# EAGLE design LNA (EAGLE 9.6.2)
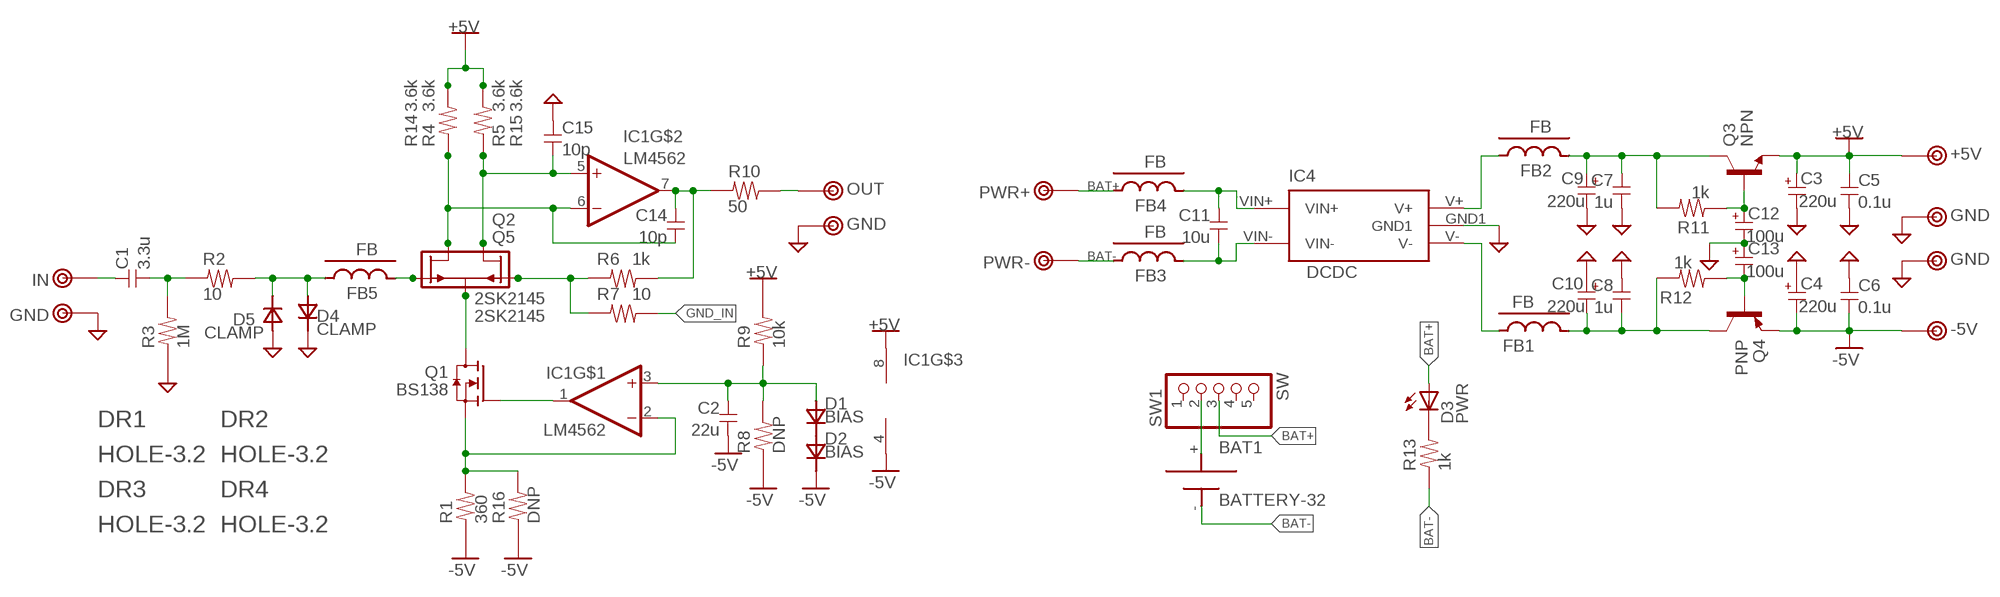
[diagram p0: schematic, sheet 1]

## Parts
BAT1  BATTERY-32  [BH-321]
C1  3.3u  C-3225  [3225]
C2  22u  C-3225  [3225]
C3  220u  CPOLE2.5-8  [E2,5-8]
C4  220u  CPOLE2.5-8  [E2,5-8]
C5  0.1u  C-1608  [1608C]
C6  0.1u  C-1608  [1608C]
C7  1u  C-1608  [1608C]
C8  1u  C-1608  [1608C]
C9  220u  CPOLE2.5-8  [E2,5-8]
C10  220u  CPOLE2.5-8  [E2,5-8]
C11  10u  C-2012  [2012]
C12  100u  CPOLE2.5-6.5  [E2.5-6.5]
C13  100u  CPOLE2.5-6.5  [E2.5-6.5]
C14  10p  C-1608  [1608C]
C15  10p  C-1608  [1608C]
D1  BIAS  DIODE-1N4148W  [SOD123]
D2  BIAS  DIODE-1N4148W  [SOD123]
D3  PWR  LED-SMD1608  [D1608]
D4  CLAMP  DIODE-323  [SOD323]
D5  CLAMP  DIODE-323  [SOD323]
DR1  HOLE-3.2  [HOLE_3.2]
DR2  HOLE-3.2  [HOLE_3.2]
DR3  HOLE-3.2  [HOLE_3.2]
DR4  HOLE-3.2  [HOLE_3.2]
FB1  FB  FB-1608FB  [1608-FB]
FB2  FB  FB-1608FB  [1608-FB]
FB3  FB  FB-1608FB  [1608-FB]
FB4  FB  FB-1608FB  [1608-FB]
FB5  FB  FB-1608FB  [1608-FB]
IC1  LM4562  OPA-2-SOP  [SOP8]
IC4  DCDC  DCDC2  [DCDC2]
Q1  BS138  NMOS-SMD  [SC59]
Q2  2SK2145  JFET-DUAL  [SOT23-5]
Q3  NPN  NPN-SOT223  [SOT223]
Q4  PNP  PNP-SOT223  [SOT223]
Q5  2SK2145  JFET-DUAL  [SOT23-5]
R1  360  R-1608  [1608]
R2  10  R-1608  [1608]
R3  1M  R-1608  [1608]
R4  3.6k  R-1608  [1608]
R5  3.6k  R-1608  [1608]
R6  1k  R-1608  [1608]
R7  10  R-1608  [1608]
R8  DNP  R-1608  [1608]
R9  10k  R-1608  [1608]
R10  50  R-1608  [1608]
R11  1k  R-1608  [1608]
R12  1k  R-1608  [1608]
R13  1k  R-1608  [1608]
R14  3.6k  R-1608  [1608]
R15  3.6k  R-1608  [1608]
R16  DNP  R-1608  [1608]
SW1  SW  SW-1X5  [1X05-BIG]
TP1  IN  TESTPIN  [TESTPIN]
TP2  GND  TESTPIN  [TESTPIN]
TP3  OUT  TESTPIN  [TESTPIN]
TP4  GND  TESTPIN  [TESTPIN]
TP5  PWR+  TESTPIN  [TESTPIN]
TP6  PWR-  TESTPIN  [TESTPIN]
TP7  +5V  TESTPIN-MID  [TESTPIN-MID]
TP8  GND  TESTPIN-MID  [TESTPIN-MID]
TP9  GND  TESTPIN-MID  [TESTPIN-MID]
TP10  -5V  TESTPIN-MID  [TESTPIN-MID]

## Nets
+5V: C3.+ C5.1 IC1.8(V+) Q3.3(E) R4.2 R5.2 R9.2 R14.2 R15.2 TP7.1
-5V: C2.2 C4.- C6.2 D2.2(K) IC1.4(V-) Q4.3(E) R1.1 R8.1 R16.1 TP10.1
BAT+: D3.A FB4.1 SW1.3 TP5.1
BAT-: BAT1.- FB3.1 R13.1 TP6.1
GND: C3.- C4.+ C5.2 C6.1 C7.2 C8.1 C9.- C10.+ C12.- C13.+ C15.1 D4.2(K) D5.1(A) IC4.GND1 R3.1 TP2.1 TP4.1 TP8.1 TP9.1
GND_IN: R7.2
N$1: IC1.1(OUT) Q1.1(G)
N$2: IC1.2(-IN) Q1.2(S) R1.2 R16.2
N$3: BAT1.+ SW1.2
N$4: D4.1(A) D5.2(K) FB5.1 R2.2
N$5: C1.2 R2.1 R3.2
N$6: C1.1 TP1.1
N$7: C15.2 IC1.5(+IN) Q2.1(D1) Q5.3(D2) R5.1 R15.1
N$8: FB5.2 Q2.4(G2) Q5.5(G1)
N$9: Q2.5(G1) Q5.4(G2) R6.1 R7.1
N$10: C2.1 D1.1(A) IC1.3(+IN) R8.2 R9.1
N$11: C14.1 IC1.7(OUT) R6.2 R10.1
N$12: C8.2 C10.- FB1.2 Q4.2(C) Q4.4(C) R12.2
N$13: C7.1 C9.+ FB2.2 Q3.2(C) Q3.4(C) R11.2
N$14: FB1.1 IC4.V-
N$15: FB2.1 IC4.V+
N$16: R10.2 TP3.1
N$17: D1.2(K) D2.1(A)
N$18: D3.K R13.2
N$19: C11.1 FB4.2 IC4.VIN+
N$20: C11.2 FB3.2 IC4.VIN-
N$21: Q1.3(D) Q2.2(S) Q5.2(S)
N$22: C12.+ Q3.1(B) R11.1
N$23: C13.- Q4.1(B) R12.1
N$24: C14.2 IC1.6(-IN) Q2.3(D2) Q5.1(D1) R4.1 R14.1
Unconnected: SW1.1 SW1.4 SW1.5

## Library data of the parts
BAT1 = my_connector:BATTERY
C1 C2 C5-C8 C11 C14 C15 = my_rcl:C
C3 C4 C9 C10 C12 C13 = my_rcl:CPOL
D1 D2 D4 D5 = my_rcl:DIODE
D3 = my_rcl:LED
DR1-DR4 = my_connector:HOLE-3.2
FB1-FB5 = my_rcl:FB
IC1 = my_ic:OPA-2
IC4 = my_ic:DCDC2
Q1 = my_ic:NMOS
Q2 Q5 = my_ic:JFET-DUAL
Q3 = my_ic:NPN
Q4 = my_ic:PNP
R1-R16 = my_rcl:R
SW1 = my_connector:SW-1X5
TP1-TP10 = my_connector:TESTPIN

## Board
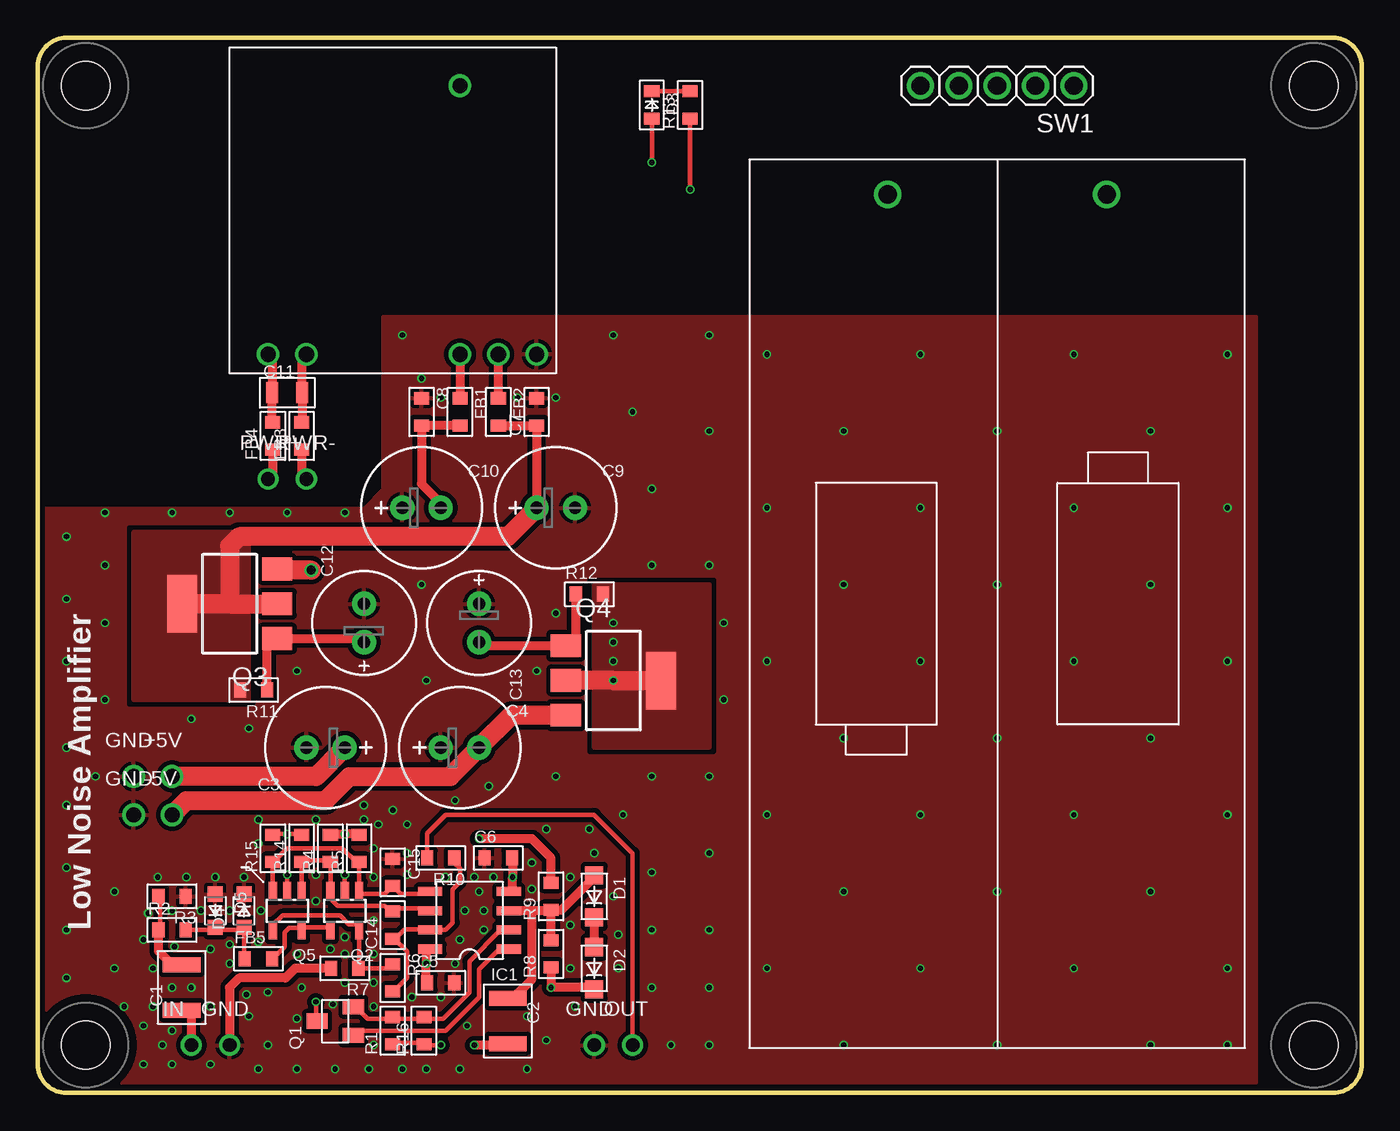
[diagram p1: board, top side]
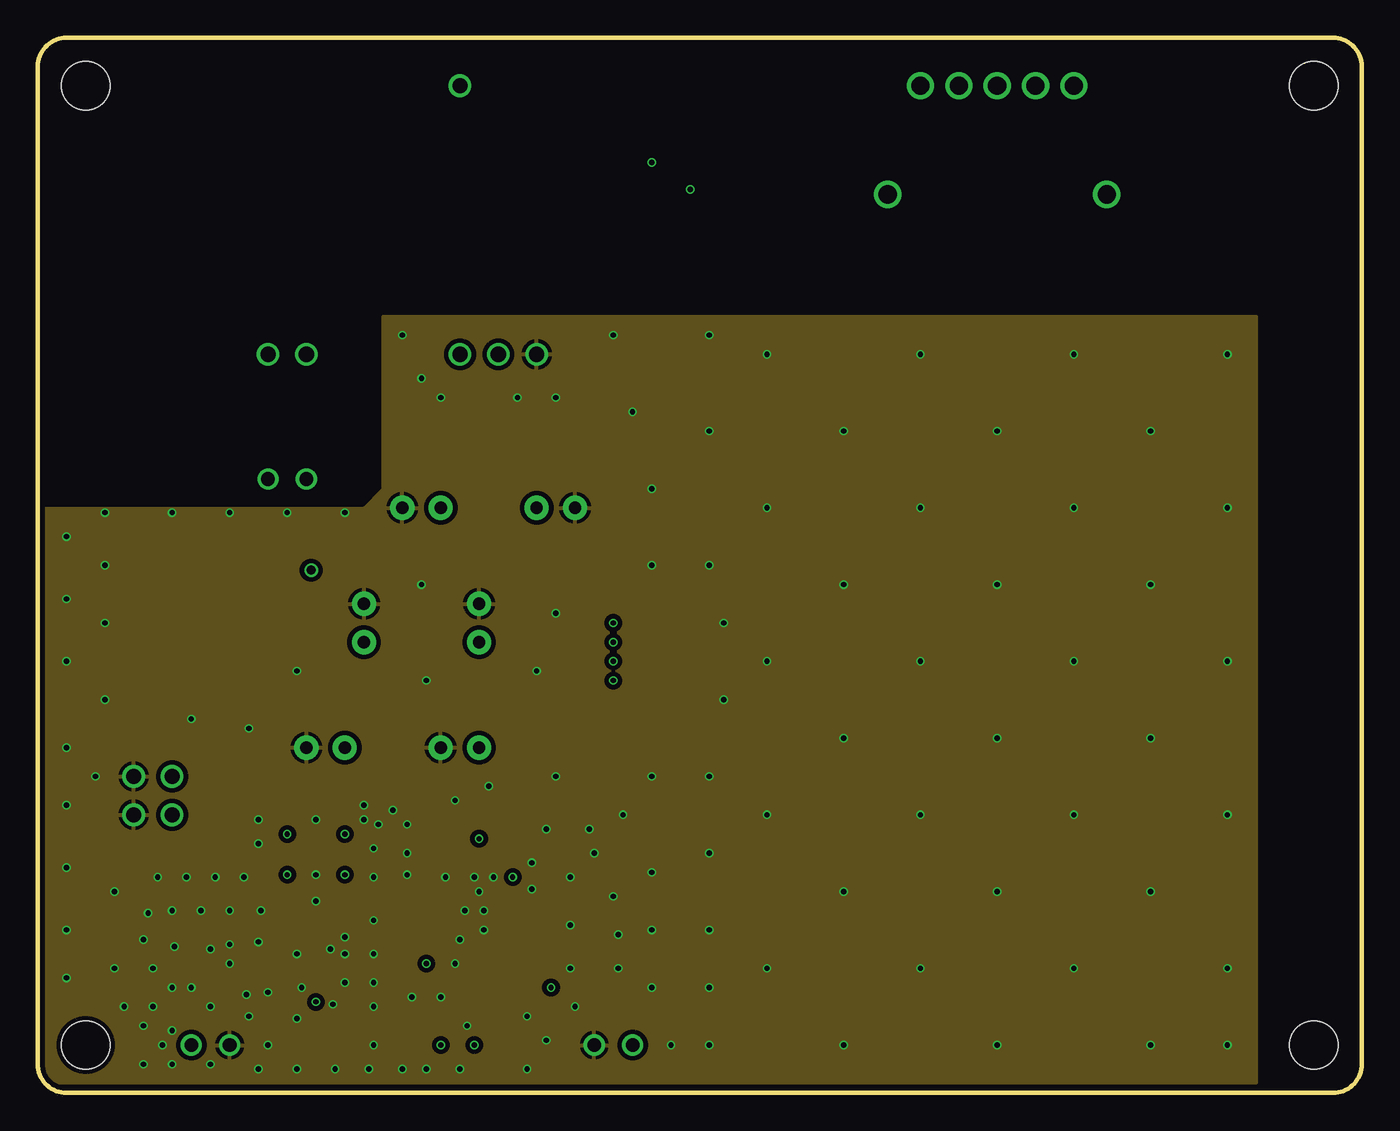
[diagram p2: board, inner layer Route2]
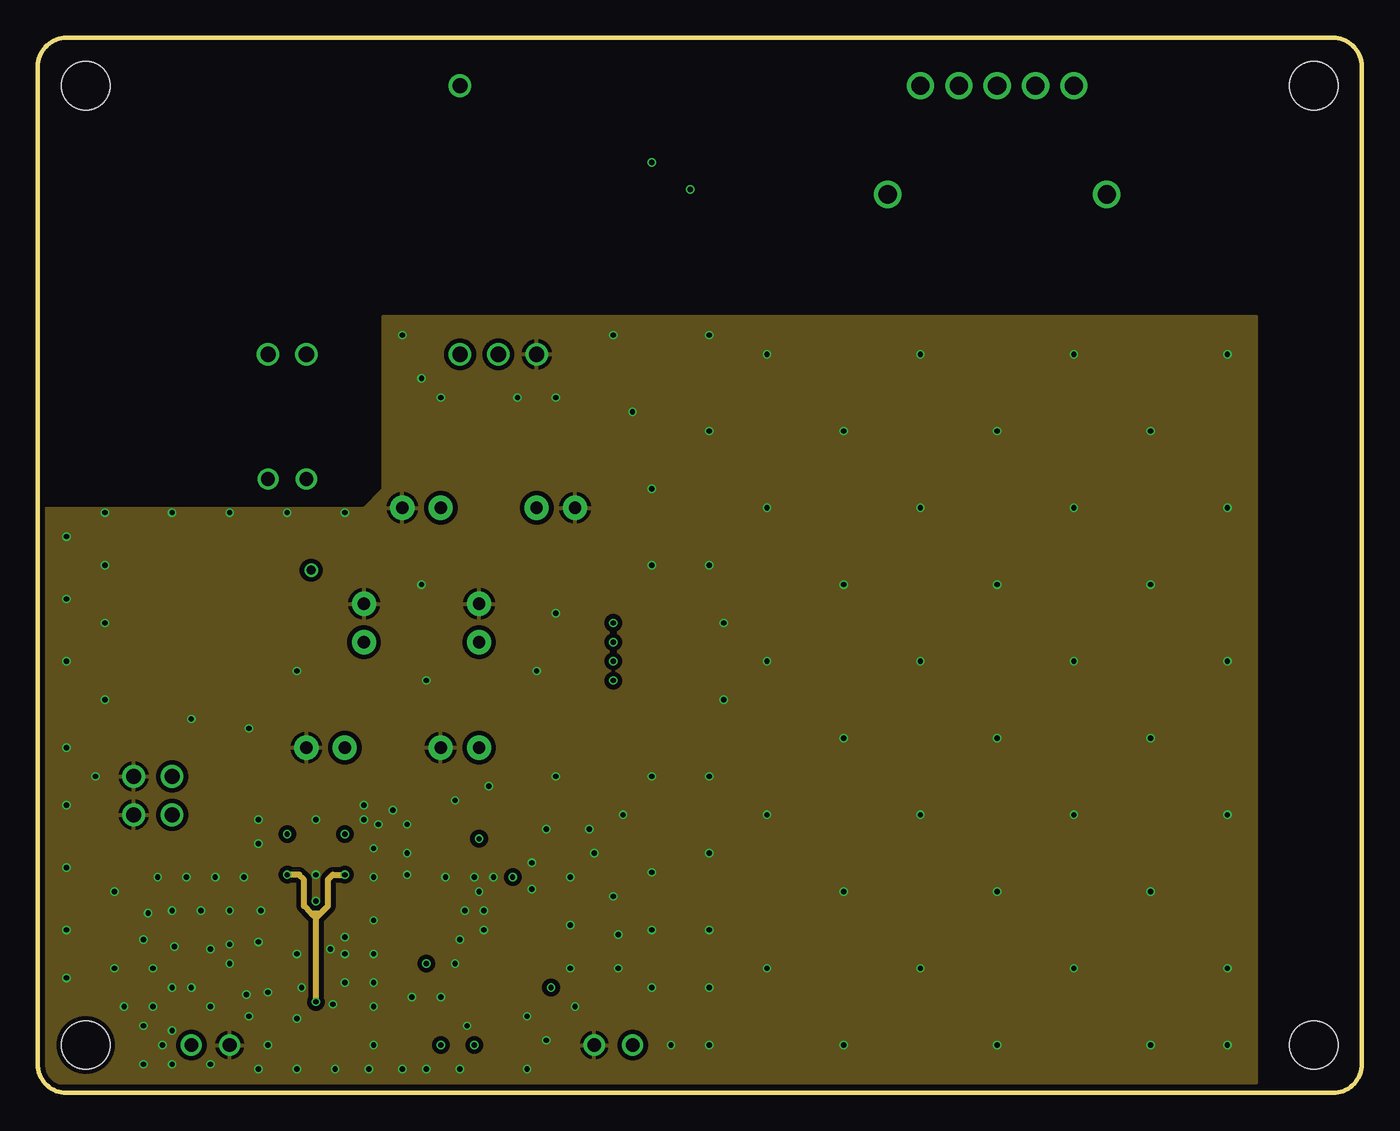
[diagram p3: board, inner layer Route15]
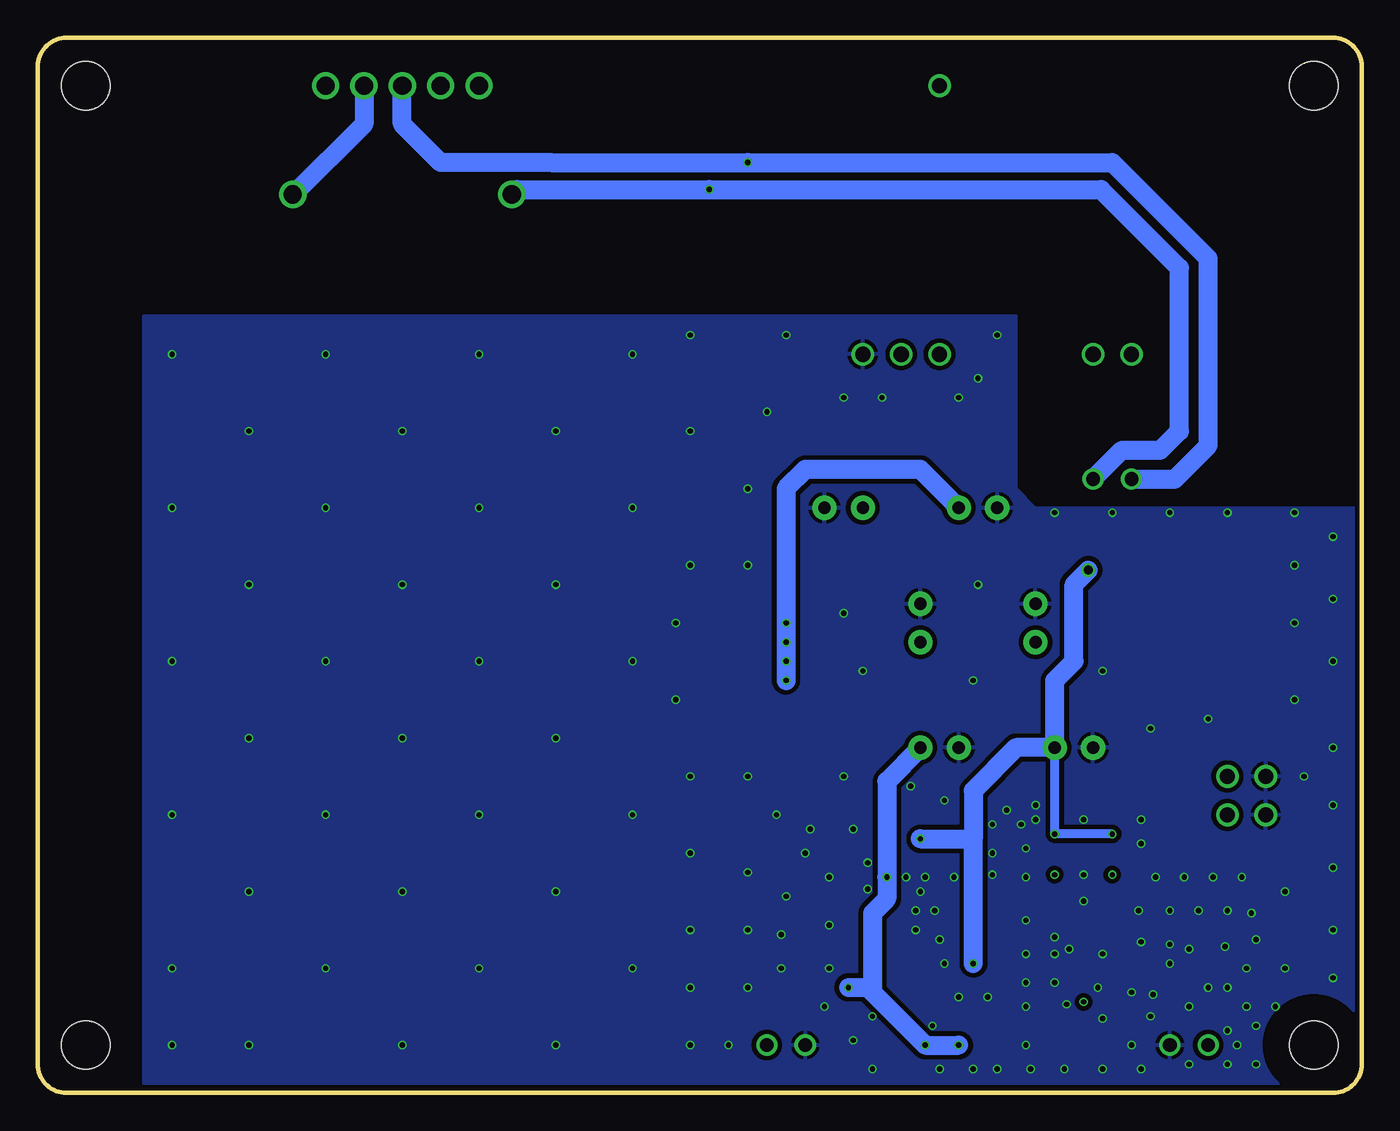
[diagram p4: board, bottom side, seen from below]

Size 87.63 x 69.85 mm. Coordinates in mm from the lower left corner, seen from the top.
Outline: 0,67.95 0,1.91 arc90 1.91,0 85.72,0 arc90 87.63,1.91 87.63,67.95 arc90 85.72,69.85 1.91,69.85 arc90 0,67.95
Copper layers (1*2*15*16): Top 0.035mm / dielectric 0.2mm / Route2 0.0175mm / dielectric 0.3mm / Route15 0.0175mm / dielectric 0.2mm / Bottom 0.035mm
Design rules "SeeedStudio_4layer_DRU_20140221": minimum track width 8mil, minimum drill 12mil, track to track 8mil, track to pad 8mil, pad to pad 8mil, via to via 8mil, smd to smd 0mil, copper to edge 10mil, drill to drill 8mil, minimum pad ring 6mil, minimum via ring 4mil, stop-mask expansion 4mil, vias tented up to drill 1mm, thermal gap 10mil

### Footprints (pad centres in the part's own frame; a part is rotated, then mirrored left to right if it is on the bottom)
BH-321 = drill 1.2: + -27.1,7.25; - -27.1,-7.25
3225 = smd 1 x 2.5: 1 -1.5,0; 2 1.5,0
E2,5-8 = drill 0.813 pad 1.6: + -1.27,0; - 1.27,0
1608C = smd 0.8 x 1: 1 -0.9,0; 2 0.9,0
2012 = smd 0.8 x 1.4: 1 -1,0; 2 1,0
E2.5-6.5 = drill 0.813 pad 1.6: + -1.27,0; - 1.27,0
SOD123 = smd 1.2 x 1.2: 1 -1.4,0; 2 1.4,0
D1608 = smd 0.8 x 1: A 0.9,0; K -0.9,0
SOD323 = smd 1 x 1: 1 -1.1,0; 2 1.1,0
HOLE_3.2 = hole 3.2: 0,0
1608-FB = smd 0.8 x 1: 1 -0.9,0; 2 0.9,0
SOP8 = smd 0.6 x 1.6: 1 -1.905,-2.6; 2 -0.635,-2.6; 3 0.635,-2.6; 4 1.905,-2.6; 5 1.905,2.6; 6 0.635,2.6; 7 -0.635,2.6; 8 -1.905,2.6
DCDC2 = drill 1: GND1 5.08,0; NC 0,17.78; V+ 2.54,0; V- 0,0; VIN+ -12.7,0; VIN- -10.16,0
SC59 = smd 1 x 1.4: 1 -0.95,-1.2; 2 0.95,-1.2; 3 0,1.2
SOT23-5 = smd 0.55 x 1.2: 1 -0.95,-1.3; 2 0,-1.3; 3 0.95,-1.3; 4 0.95,1.3; 5 -0.95,1.3
SOT223 = smd 1.5 x 2: 1 -2.3,-3.15; 2 0,-3.15; 3 2.3,-3.15 | smd 3.8 x 2: 4 0,3.15
1608 = smd 0.8 x 1: 1 -0.9,0; 2 0.9,0
1X05-BIG = drill 1.2: 1 -5.08,0; 2 -2.54,0; 3 0,0; 4 2.54,0; 5 5.08,0
TESTPIN = drill 0.9 pad 1.4: 1 0,0
TESTPIN-MID = drill 1 pad 1.4: 1 0,0

### Placement (x,y rotation side)
BAT1  63.5,32.38 270 top
C1  9.53,6.98 90 top
C2  31.11,4.76 270 top
C3  19.05,22.86 180 top
C4  27.94,22.86 0 top
C5  26.67,7.3 0 top
C6  30.48,15.56 0 top
C7  33.02,45.09 90 top
C8  25.4,45.09 270 top
C9  34.29,38.73 0 top
C10  25.4,38.73 0 top
C11  16.51,46.35 0 top
C12  21.59,31.12 90 top
C13  29.21,31.12 270 top
C14  23.5,11.11 90 top
C15  23.5,14.61 270 top
D1  36.83,13.02 270 top
D2  36.83,8.26 270 top
D3  40.64,65.41 270 top
D4  13.65,12.06 90 top
D5  11.75,12.06 270 top
DR1  3.17,3.17 0 top
DR2  84.45,3.17 0 top
DR3  3.17,66.68 0 top
DR4  84.45,66.68 0 top
FB1  27.94,45.09 270 top
FB2  30.48,45.09 270 top
FB3  17.46,43.5 90 top
FB4  15.56,43.5 90 top
FB5  14.61,8.89 0 top
IC1  28.57,11.43 90 top
IC4  27.94,48.89 0 top
Q1  19.68,4.76 90 top
Q2  20.32,12.06 180 top
Q3  12.7,32.38 90 top
Q4  38.1,27.31 270 top
Q5  16.51,12.06 180 top
R1  23.5,4.13 90 top
R2  8.89,10.79 0 top
R3  8.89,13.02 180 top
R4  19.37,16.19 90 top
R5  21.27,16.19 90 top
R6  23.5,7.62 270 top
R7  20.32,8.26 180 top
R8  33.97,9.21 90 top
R9  33.97,13.02 90 top
R10  26.67,15.56 180 top
R11  14.29,26.67 180 top
R12  36.51,33.02 0 top
R13  43.18,65.41 90 top
R14  17.46,16.19 90 top
R15  15.56,16.19 90 top
R16  25.56,4.13 90 top
SW1  63.5,66.68 180 top
TP1  10.16,3.17 0 top
TP2  36.83,3.17 0 top
TP3  39.37,3.17 0 top
TP4  12.7,3.17 0 top
TP5  15.24,40.64 0 top
TP6  17.78,40.64 0 top
TP7  8.89,20.96 0 top
TP8  6.35,20.96 0 top
TP9  6.35,18.42 0 top
TP10  8.89,18.42 0 top

### Tracks (layer width: path | path; a pad name or v marks a point on that pad's centre or on a via)
+5V  (via drill 0.35, 0.6)
  Top 0.305: R15.2 15.61,17.15 v16.51,17.15 17.41,17.15 R14.2
  Top 0.61: IC1.8 25.72,9.53 v25.72,8.57 25.72,7.35 C5.1 | R9.2 33.97,15.56 32.7,16.83 v29.21,16.83 | R4.2 19.42,17.15 v20.32,17.15 21.22,17.15 R5.2
  Top 1.27: v18.1,34.61 15.93,34.61 Q3.3 | C3.+ 18.41,20.96 TP7.1
  Bottom 0.61: C3.+ 20.32,22.54 v20.32,17.15 v16.51,17.15
  Bottom 1.27: v25.72,8.57 25.72,16.83 | v29.21,16.83 25.72,16.83 | 25.72,16.83 25.72,20 22.86,22.86 C3.+ 20.32,27.31 19.05,28.58 19.05,33.66 v18.1,34.61
-5V  (via drill 0.35)
  Top 0.305: v26.67,3.17 25.61,3.17 R16.1 25.45,3.33 23.6,3.33 R1.1
  Top 0.61: IC1.4 31.43,13.33 v31.43,14.29 31.43,15.5 C6.2 | C2.2 31.03,3.17 v28.89,3.17 | R8.1 v33.97,6.98 36.7,6.98 D2.2
  Top 1.27: Q4.3 31.36,25.01 C4.- 27.3,20.96 20.64,20.96 19.05,19.37 9.84,19.37 TP10.1
  Bottom 1.27: v33.97,6.98 33.34,6.98 33.02,6.98 32.7,6.98 | 32.7,6.98 32.38,6.98 32.38,11.91 31.43,12.86 v31.43,14.29 31.43,20.64 C4.- | v26.67,3.17 v28.89,3.17 32.7,6.98
BAT+  (via drill 0.35)
  Top 0.305: D3.A v40.64,61.59
  Top 0.61: FB4.1 15.56,40.96 TP5.1
  Bottom 1.27: TP5.1 12.38,40.64 10.16,42.86 10.16,55.24 16.51,61.59 v40.64,61.59 53.66,61.59 60.96,61.59 63.5,64.14 SW1.3
BAT-  (via drill 0.35)
  Top 0.305: R13.1 v43.18,59.8
  Top 0.61: FB3.1 17.46,40.96 TP6.1
  Bottom 1.27: TP6.1 15.88,42.54 13.34,42.54 12.06,43.81 12.06,54.61 17.26,59.8 v43.18,59.8 55.93,59.8 BAT1.-
GND  (via drill 0.35)
  other vias: 20.32,38.42 16.51,38.42 12.7,38.42 8.89,38.42 4.45,38.42 4.45,34.92 4.45,31.12 4.45,26.04 10.16,24.77 3.81,20.96 14.61,16.51 18.41,18.1 22.54,17.78 24.45,17.78 24.45,14.45 28.89,14.29 26.99,14.29 32.7,15.24 33.66,17.46 36.83,15.88 35.24,14.29 38.1,13.02 35.24,11.11 35.24,8.26 38.42,8.26 32.38,5.08 8.89,6.98 10.16,6.98 11.43,9.53 15.24,6.67 13.97,5.08 12.7,12.06 10.79,12.06 11.75,14.29 13.65,14.29 22.23,16.19 22.23,14.29 22.23,7.3 17.14,4.92 15.24,3.17 21.91,1.59 19.68,1.59 24.13,1.59 27.94,1.59 32.38,1.59 35.56,5.71 38.42,10.48 41.91,3.17 40.64,6.98 40.64,10.79 40.64,14.61 38.73,18.42 29.84,20.32 34.29,20.96 17.14,27.94 13.97,24.13 25.72,27.31 33.02,27.94 34.29,31.75 26.67,46.04 25.4,47.31 31.75,46.04 34.29,46.04 7.94,14.29 8.89,12.06 7.3,11.91 6.99,1.91 5.08,8.26 5.08,13.33 23.5,18.73 24.45,15.88 21.59,19.05 27.62,19.37 36.51,17.46 28.26,12.06 27.62,8.57 24.77,6.35 25.4,33.66 24.13,50.16 38.1,50.16 44.45,50.16 44.45,43.81 44.45,34.92 40.64,34.92 40.64,40 39.37,45.09 44.45,20.96 40.64,20.96 44.45,15.88 44.45,10.79 44.45,6.98 44.45,3.17 45.4,26.04 45.4,31.12 19.37,9.53 8.26,3.17 6.99,10.16 9.84,14.29 22.23,11.43 22.23,9.21 19.53,5.87 33.66,3.49 11.43,5.71 7.62,5.71 7.62,8.26 12.7,8.57 1.91,36.83 1.91,32.7 1.91,28.58 1.91,22.86 1.91,19.05 1.91,14.92 1.91,10.79 1.91,7.62 14.61,1.59 11.43,1.91 8.89,4.13 48.26,48.89 58.42,48.89 68.58,48.89 78.74,48.89 53.34,43.81 63.5,43.81 73.66,43.81 78.74,38.73 68.58,38.73 58.42,38.73 48.26,38.73 53.34,33.66 63.5,33.66 73.66,33.66 78.74,28.58 68.58,28.58 58.42,28.58 48.26,28.58 53.34,23.5 63.5,23.5 73.66,23.5 78.74,18.42 68.58,18.42 58.42,18.42 48.26,18.42 53.34,13.33 63.5,13.33 73.66,13.33 78.74,8.26 68.58,8.26 58.42,8.26 48.26,8.26 53.34,3.17 63.5,3.17 73.66,3.17 78.74,3.17 18.41,14.45 14.76,12.06 20.32,10.32 17.14,9.21 18.41,12.7 20.32,7.3 22.23,5.71 14.61,10 17.46,6.98 13.81,6.51 9.05,9.68 12.7,9.84 14.61,18.1 21.59,18.1 27.94,10.16 29.53,10.79 29.21,13.33 29.53,12.06 32.7,13.49 8.89,1.91 5.71,5.71 6.99,4.45 28.42,4.45 20.32,9.21 26.67,6.35 25.72,1.59 17.14,1.59 22.23,3.17 30.16,14.29
  pour Top (isolate 0.305, rank 4): 80.64,0.64 0,0.64 0,38.73 21.59,38.73 22.86,40 22.86,51.43 80.64,51.43
  pour Route2 (isolate 0.305, rank 4): 80.64,0.64 0,0.64 0,38.73 21.59,38.73 22.86,40 22.86,51.43 80.64,51.43
  pour Route15 (isolate 0.305, rank 4): 80.64,0.64 0,0.64 0,38.73 21.59,38.73 22.86,40 22.86,51.43 80.64,51.43
  pour Bottom (isolate 0.305, rank 4): 80.64,0.64 0,0.64 0,38.73 21.59,38.73 22.86,40 22.86,51.43 80.64,51.43
GND_IN
  Top 0.61: R7.2 17.04,8.26 16.4,7.62 13.34,7.62 12.7,6.98 12.7,3.49
N$1
  Top 0.305: IC1.1 30.54,9.53 29.21,8.2 29.21,6.35 26.99,4.13 20.89,4.13 Q1.1
N$2
  Top 0.305: IC1.2 30.64,10.79 28.57,8.73 28.57,6.67 26.83,4.92 25.66,4.92 R16.2 25.45,4.92 23.6,4.92 R1.2 23.39,4.92 21.84,4.92 21.04,5.71 Q1.2
N$3
  Bottom 1.27: SW1.2 66.04,64.14 70.69,59.48 BAT1.+
N$4
  Top 0.305: R2.2 9.82,10.77 9.85,10.79 11.58,10.79 D5.2 11.92,10.79 13.48,10.79 D4.1 | 13.82,10.79 D4.1 | 13.82,10.79 D4.1 | 13.82,10.79 D4.1 | FB5.1 13.65,8.94 13.65,10.62 13.82,10.79
N$5
  Top 0.305: R2.1 8.1,10.9 8.1,12.91 R3.2
  Top 0.61: C1.2 8.89,8.48 7.99,9.38 R2.1
N$6
  Top 0.61: C1.1 10.16,5.48 TP1.1
N$7
  Top 0.305: R5.1 | IC1.5 25.4,13.33 25.24,13.18 24.02,13.18 C15.2 22.97,13.18 21.46,13.18 Q2.1 R5.1 | Q5.3 R15.1 15.61,15.29 16.51,16.19 20.16,16.19 21.06,15.29 R5.1
N$8
  Top 0.305: Q2.4 19.37,10.92 19.34,10.95 17.65,10.95 Q5.5 17.3,10.92 16.64,10.92 16.35,10.64 16.35,9.68 15.56,8.89 FB5.2
N$9
  Top 0.305: R6.1 23.23,8.26 R7.1 21.27,8.3 Q2.5 21.27,11.16 20.59,11.16 20,11.75 16.19,11.75 15.56,11.12 Q5.4
N$10
  Top 0.61: 33.92,12.06 32.7,12.06 | 32.7,12.06 IC1.3 | 33.92,12.06 R9.1 34.66,12.12 36.83,14.29 D1.1 | R8.2 33.97,12.01 33.92,12.06 | C2.1 31.43,6.26 32.7,7.53 32.7,12.06
N$11
  Top 0.305: R10.1 27.57,15.24 27.94,14.87 27.94,13.97 27.46,13.49 27.46,11.27 26.99,10.79 IC1.7 25.4,10.79 25.35,10.85 24.29,10.85 23.65,10.21 C14.1 23.6,10.21 24.45,9.37 24.45,7.62 23.55,6.72 R6.2
N$12  (via drill 0.35)
  Top 0.61: FB1.2 C8.2 25.4,40.32 26.67,39.05 C10.-
  Top 1.27: Q4.2 v38.1,27.31 Q4.4
  Bottom 1.27: C10.- 29.21,41.27 36.83,41.27 38.1,40 v38.1,31.12 v38.1,29.85 v38.1,28.58 v38.1,27.31
  pour Top (isolate 0.203, no thermals): 36.83,33.66 36.83,22.86 44.45,22.86 44.45,33.66
N$13
  Top 0.61: FB2.2 C7.1 C9.+
  Top 1.27: C9.+ 31.11,36.83 13.34,36.83 12.7,36.2 12.7,32.38 | 12.7,32.38 Q3.4 | 12.7,32.38 Q3.2
  pour Top (isolate 0.203, no thermals): 6.35,37.15 6.35,26.04 13.97,26.04 13.97,37.15
N$14
  Top 0.61: IC4.V- FB1.1
N$15
  Top 0.61: IC4.V+ FB2.1
N$16
  Top 0.305: R10.2 25.77,17.2 26.99,18.42 36.83,18.42 39.37,15.88 TP3.1
N$17
  Top 0.61: D1.2 D2.1
N$18
  Top 0.305: D3.K R13.2
N$19
  Top 0.61: IC4.VIN+ 15.51,48.62 C11.1 15.51,44.45 FB4.2
N$20
  Top 0.61: IC4.VIN- 17.51,48.62 C11.2 17.51,44.45 FB3.2
N$21  (via drill 0.35)
  Top 0.305: Q2.2 v20.32,14.45 | v16.51,14.45 Q5.2 | Q1.3 18.41,4.83 v18.41,6.03
  Route15 0.406: v16.51,14.45 17.3,14.45 17.62,14.13 17.62,12.38 18.1,11.91 | v20.32,14.45 19.53,14.45 19.21,14.13 19.21,12.38 18.73,11.91 | v18.41,6.03 18.41,11.59 | 18.41,11.59 18.73,11.91 | 18.41,11.59 18.1,11.91 | 18.1,11.91 18.73,11.91
N$22
  Top 0.61: R11.1 15.19,29.79 15.48,30.09 Q3.1 21.35,30.09 C12.+
N$23
  Top 0.61: R12.1 35.61,30.27 Q4.1 29.45,29.61 C13.-
N$24
  Top 0.305: IC1.6 25.4,12.06 25.24,12.22 23.71,12.22 C14.2 23.34,12.01 22.97,12.38 19.84,12.38 19.37,12.86 Q2.3 R4.1 19.26,15.4 17.57,15.4 R14.1 Q5.1

### Text on the board
tPlace: Low Noise Amplifier